# EAGLE design IR_sensor (EAGLE 9.6.2)
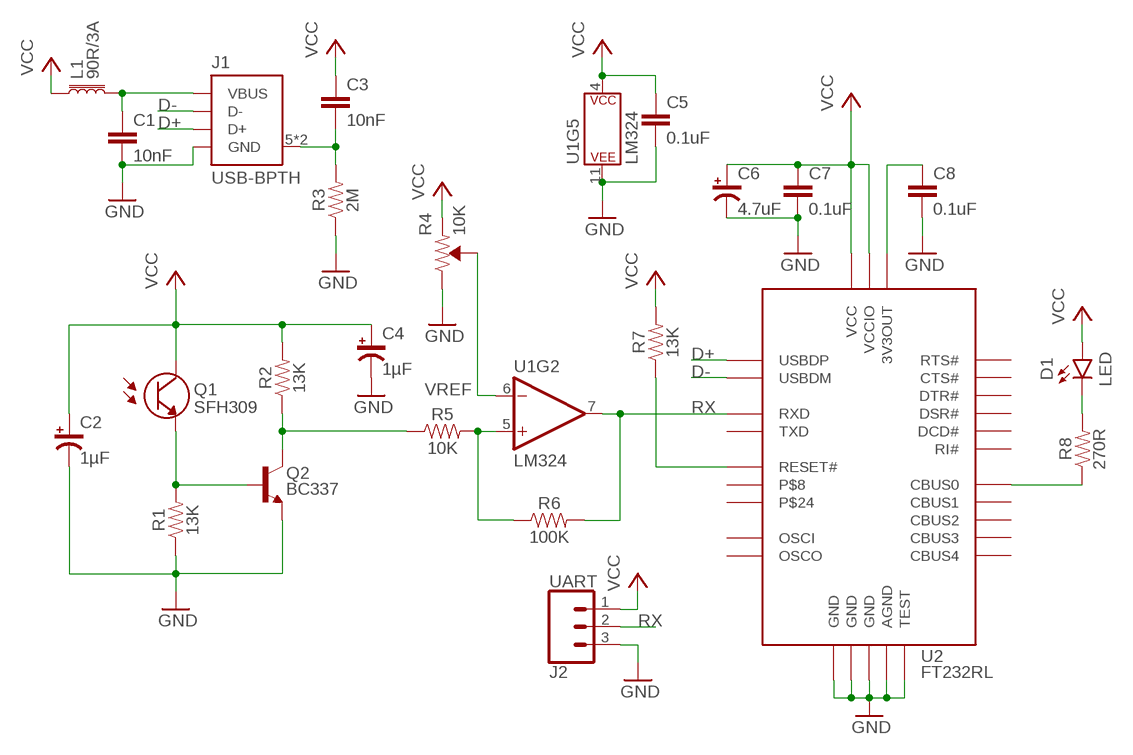
[diagram p0: schematic, sheet 1]

## Parts
C1  10nF  CAPPTH2.5MM  [CAP-PTH-2.5MM]
C2  1µF  CAP-POL  [CPOL-RADIAL-2.5MM-5MM]
C3  10nF  CAPPTH-5MM  [CAP-PTH-5MM]
C4  1µF  CAP-POL  [CPOL-RADIAL-2.5MM-5MM]
C5  0.1uF  CAPPTH-5MM  [CAP-PTH-5MM]
C6  4.7uF  CAP-POL  [CPOL-RADIAL-2.5MM-5MM]
C7  0.1uF  CAPPTH-5MM  [CAP-PTH-5MM]
C8  0.1uF  CAPPTH-5MM  [CAP-PTH-5MM]
D1  LED  LEDPTH-5MM  [LED_5MM]
J1  USB-BPTH  [USB-B-PTH]
J2  UART  CONN_03  [1X03]
L1  90R/3A  FERRITE_BEADPTH  [AXIAL-0.3]
Q1  SFH309  PHOTOTRANSISTORPTH-R  [LED_3MM_R]
Q2  BC337  NPNPTH  [TO-92]
R1  13K  RESISTORPTH  [AXIAL-0.3]
R2  13K  RESISTORPTH  [AXIAL-0.3]
R3  2M  RESISTORPTH  [AXIAL-0.3]
R4  10K  TRIMPOT  [TRIMPOT]
R5  10K  RESISTORPTH  [AXIAL-0.3]
R6  100K  RESISTORPTH  [AXIAL-0.3]
R7  13K  RESISTORPTH  [AXIAL-0.3]
R8  270R  RESISTORPTH  [AXIAL-0.3]
U1  LM324  OP_AMP  [DIP14]
U2  FT232RL  [TSSOP-28-BL]

## Nets
ADC: Q2.3(C) R2.P$1 R5.P$1
D+: J1.3(D+) U2.15(USBDP)
D-: J1.2(D-) U2.16(USBDM)
GND: C1.2 C2.2(-) C4.2(-) C5.2 C6.2(-) C7.2 C8.2 J1.4(GND) J2.3 Q2.1(E) R1.P$1 R3.P$1 R4.P$2(CW) U1.11(P$V-) U2.7(GND) U2.18(GND) U2.21(GND) U2.25(AGND) U2.26(TEST)
N$1: C1.1 J1.1(VBUS) L1.P$2
N$5: R5.P$2 R6.P$1 U1.5(+IN)
N$6: Q1.A(E) Q2.2(B) R1.P$2
N$7: C8.1 U2.17(3V3OUT)
N$8: D1.K R8.P$2
N$10: R8.P$1 U2.23(CBUS0)
N$12: C3.2 J1.5(SHIELD) J1.6(SHIELD) R3.P$2
N$13: R7.P$1 U2.19(RESET#)
RX: J2.2 R6.P$2 U1.7(OUT) U2.5(RXD)
VCC: C2.1(+) C3.1 C4.1(+) C5.1 C6.1(+) C7.1 D1.A J2.1 L1.P$1 Q1.K(C) R2.P$2 R4.P$1(CCW) R7.P$2 U1.4(P$V+) U2.4(VCCIO) U2.20(VCC)
VREF: R4.P$3(WIPER) U1.6(-IN)
Unconnected: U1.1(OUT) U1.2(-IN) U1.3(+IN) U1.8(OUT) U1.9(-IN) U1.10(+IN) U1.12(+IN) U1.13(-IN) U1.14(OUT) U2.1(TXD) U2.2(DTR#) U2.3(RTS#) U2.6(RI#) U2.8 U2.9(DSR#) U2.10(DCD#) U2.11(CTS#) U2.12(CBUS4) U2.13(CBUS2) U2.14(CBUS3) U2.22(CBUS1) U2.24 U2.27(OSCI) U2.28(OSCO)

## Library data of the parts
C1 C3 C5 C7 C8 = CUSTOM_COMPONENTS:CAP
C2 C4 C6 = CUSTOM_COMPONENTS:CAP-POL
D1 = CUSTOM_COMPONENTS:LED
J1 = CUSTOM_COMPONENTS:USB-B
J2 = CUSTOM_COMPONENTS:CONN_03: Multi connection point. Often used as Generic Header-pin footprint for 0.1 inch spaced/style header connections On any of the 0.1 inch spaced packages, you can populate with these: Break Away Headers - Straight <https://www.sparkfun.com/products/116> (PRT-00116) Break Away Male Headers - Right Angle <https://www.sparkfun.com/products/553> (PRT-00553) Female Headers <https://www.sparkfun.com/products/115> (PRT-00115) Break Away Headers - Machine Pin <https://www.sparkfun.com/products/117> (PRT-00117) Break Away Female Headers - Swiss Machine Pin <https://www.sparkfun.com/products/743> (PRT-00743) Stackable Header - 3 Pin (Female, 0.1") <https://www.sparkfun.com/products/13875> (PRT-13875) For SCREWTERMINALS and SPRING TERMINALS visit here: Screw Terimnals on SparkFun.com <https://www.sparkfun.com/search/results?term=Screw+Terminals> (5mm/3.5mm/2.54mm spacing) This device is also useful as a general connection point to wire up your design to another part of your project. Our various solder wires solder well into these plated through hole pads. Hook-Up Wire - Assortment (Stranded, 22 AWG) <https://www.sparkfun.com/products/11375> (PRT-11375) Hook-Up Wire - Assortment (Solid Core, 22 AWG) <https://www.sparkfun.com/products/11367> (PRT-11367) View the entire wire category on our website here <https://www.sparkfun.com/categories/141> Special notes: Molex polarized connector foot print use with SKU : PRT-08232 with associated crimp pins and housings.
L1 = CUSTOM_COMPONENTS:FERRITE_BEAD
Q1 = CUSTOM_COMPONENTS:PHOTOTRANSISTOR: Check prices <https://pricing.snapeda.com/parts/BPW85/Vishay/view-part?ref=eda>
Q2 = CUSTOM_COMPONENTS:NPN
R1-R3 R5-R8 = CUSTOM_COMPONENTS:RESISTOR
R4 = CUSTOM_COMPONENTS:TRIMPOT
U1 = CUSTOM_COMPONENTS:OP_AMP: IC Quad Op Amp Jellybean quad op-amp
U2 = CUSTOM_COMPONENTS:FT232RL

## Board
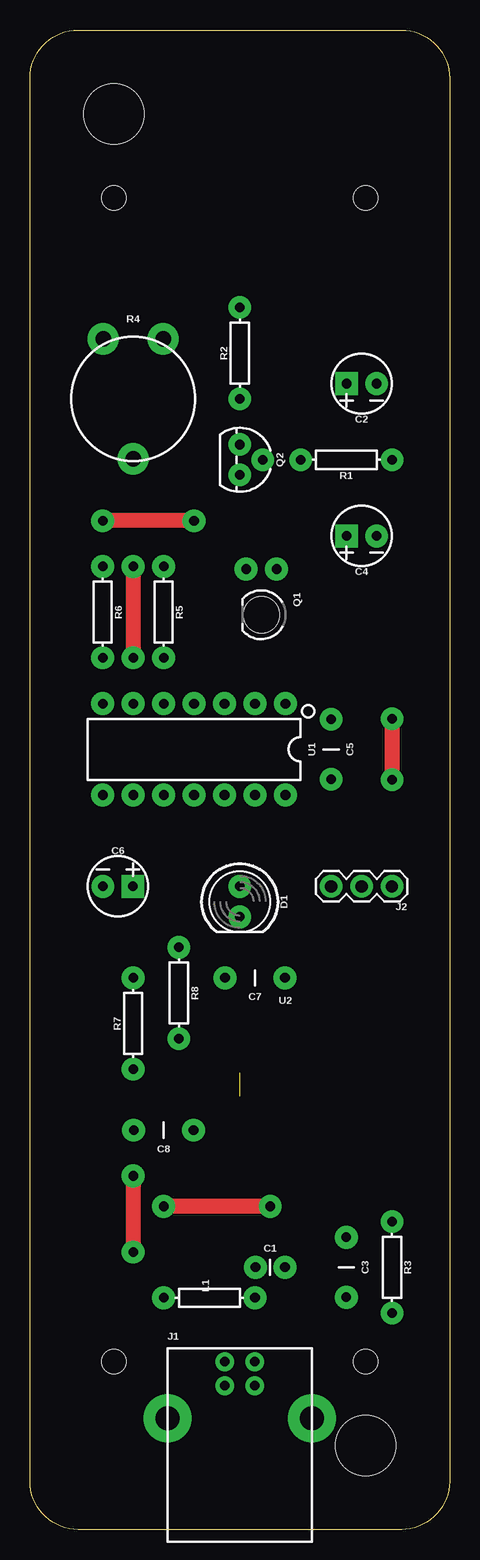
[diagram p1: board, top side]
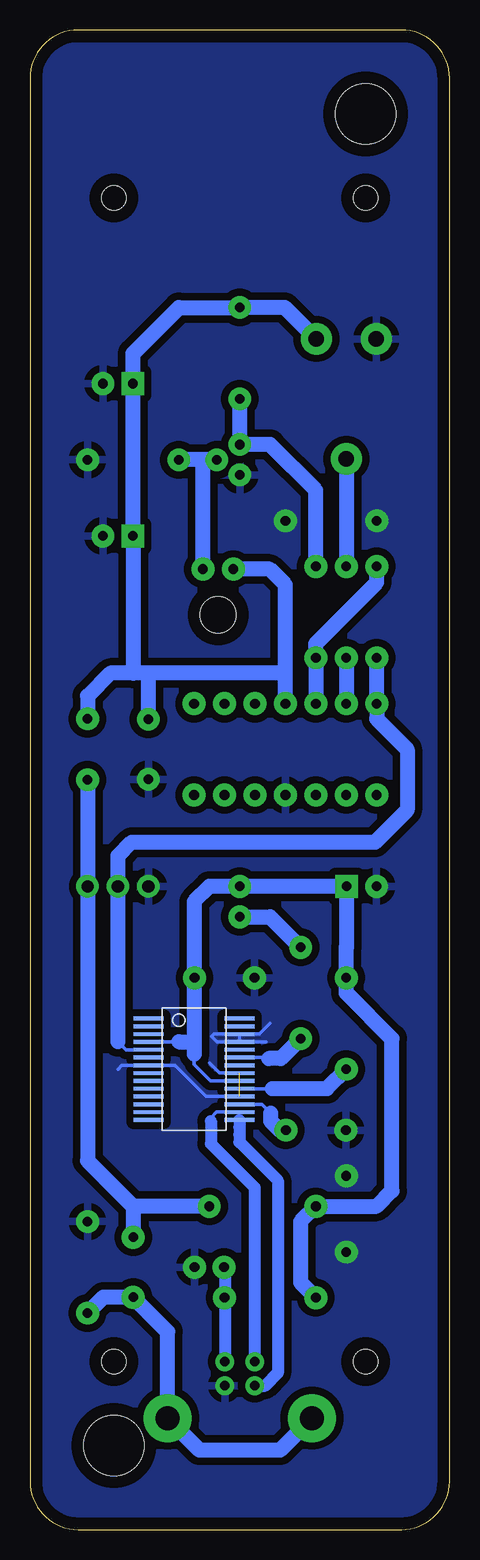
[diagram p2: board, bottom side, seen from below]

Size 35 x 125 mm. Coordinates in mm from the lower left corner, seen from the top.
Outline: 4,125 31,125 arc-90 35,121 35,4 arc-90 31,0 4,0 arc-90 0,4 0,121 arc-90 4,125
Copper layers (1*16): Top 0.035mm / dielectric 1.5mm / Bottom 0.035mm
Design rules "pth-smd-mix": minimum track width 10mil, minimum drill 0.35mm, track to track 24mil, track to pad 24mil, pad to pad 12mil, via to via 24mil, smd to smd 10mil, copper to edge 40mil, drill to drill 24mil, minimum pad ring 10mil, minimum via ring 8mil, stop-mask expansion 4mil, vias tented up to drill 0mil, thermal gap 24mil
Holes 2 mm at 28,111 7,111 28,14 7,14
Holes 5 mm at 28,7 7,118

### Footprints (pad centres in the part's own frame; a part is rotated, then mirrored left to right if it is on the bottom)
CAP-PTH-2.5MM = drill 0.8 pad 1.9: 1 -1.23,0; 2 1.23,0
CPOL-RADIAL-2.5MM-5MM = drill 0.8 pad 1.9 square: 1 1.25,0 | drill 0.8 pad 1.9: 2 -1.25,0
CAP-PTH-5MM = drill 0.8 pad 1.9: 1 -2.5,0; 2 2.5,0
LED_5MM = drill 0.8 pad 1.9: A -1.27,0; K 1.27,0
USB-B-PTH = drill 0.8 pad 1.575: 1 1.25,14.99; 2 -1.25,14.99; 3 -1.25,12.99; 4 1.25,12.99 | drill 2 pad 4: 5 -6.02,10.28; 6 6.02,10.28
1X03 = drill 1.016 pad 1.88: 1 0,0; 2 2.54,0; 3 5.08,0
AXIAL-0.3 = drill 0.8 pad 1.9: P$1 -3.81,0; P$2 3.81,0
LED_3MM_R = drill 0.8 pad 1.9: A -1.27,-3.81; K 1.27,-3.81 | hole 3: 0,0
TO-92 = drill 0.8 pad 1.88: 1 1.27,0; 2 0,1.905; 3 -1.27,0
TRIMPOT = drill 1.3 pad 2.6: P$1 -2.5,-5; P$2 2.5,-5; P$3 0,5
DIP14 = drill 0.8 pad 1.9: 1 -7.62,-3.81; 2 -5.08,-3.81; 3 -2.54,-3.81; 4 0,-3.81; 5 2.54,-3.81; 6 5.08,-3.81; 7 7.62,-3.81; 8 7.62,3.81; 9 5.08,3.81; 10 2.54,3.81; 11 0,3.81; 12 -2.54,3.81; 13 -5.08,3.81; 14 -7.62,3.81
TSSOP-28-BL = smd 2.5 x 0.32 bottom: 1 3.775,4.225; 2 3.775,3.575; 3 3.775,2.925; 4 3.775,2.275; 5 3.775,1.625; 6 3.775,0.975; 7 3.775,0.325; 8 3.775,-0.325; 9 3.775,-0.975; 10 3.775,-1.625; 11 3.775,-2.275; 12 3.775,-2.925; 13 3.775,-3.575; 14 3.775,-4.225; 15 -3.775,-4.225; 16 -3.775,-3.575; 17 -3.775,-2.925; 18 -3.775,-2.275; 19 -3.775,-1.625; 20 -3.775,-0.975; 21 -3.775,-0.325; 22 -3.775,0.325; 23 -3.775,0.975; 24 -3.775,1.625; 25 -3.775,2.275; 26 -3.775,2.925; 27 -3.775,3.575; 28 -3.775,4.225

### Placement (x,y rotation side)
C1  20.04,21.86 0 top
C2  27.66,95.52 180 top
C3  26.39,21.86 270 top
C4  27.66,82.82 180 top
C5  25.12,65.04 270 top
C6  7.34,53.61 0 top
C7  18.77,45.99 180 top
C8  11.15,33.29 180 top
D1  17.5,52.34 270 top
J1  17.5,-1 0 top
J2  30.2,53.61 180 top
L1  14.96,19.32 0 top
Q1  19.3,76.25 180 top
Q2  17.5,89.17 270 top
R1  26.39,89.17 180 top
R2  17.5,98.06 90 top
R3  30.2,21.86 270 top
R4  8.61,94.25 180 top
R5  11.15,76.47 270 top
R6  6.07,76.47 270 top
R7  8.61,42.18 90 top
R8  12.42,44.72 90 top
U1  13.69,65.04 180 top
U2  21.31,38.37 0 top

### Tracks (layer width: path | path; a pad name or v marks a point on that pad's centre or on a via)
ADC
  Bottom 1.27: R5.P$1 11.15,86.63 14.96,90.44 Q2.3 R2.P$1
D+
  Bottom 1.016: J1.3 15.36,11.99 14.32,13.04 14.32,29.1 17.54,32.31 arc0 U2.15
D-
  Bottom 0.305: U2.16 19.42,34.8 19.91,34.31 19.91,34.05
  Bottom 1.016: J1.2 16.25,28.48 19.91,32.15 19.91,34.05
GND  (via drill 0.8 pad 1.9)  (1 unrouted)
  Top 1.27: v13.69,84.09 v6.07,84.09 | v8.61,29.48 v8.61,23.13
  Bottom 0.305: U2.18 20.3,36.09 22.91,38.7 U2.7 27.34,38.7 27.66,38.37 | U2.26 19.66,41.3 19.85,41.1 19.39,40.64 U2.25 | U2.25 U2.26 | U2.26 15.85,41.3 14.96,42.18 | U2.25 15.33,40.64 | U2.21 19.21,38.05 20.04,38.88
  pour Bottom: 4,0 31,0 arc90 35,4 35,121 arc90 31,125 4,125 arc90 0,121 0,4 arc90
N$1
  Bottom 1.016: L1.P$2 18.75,19.32 | 18.75,19.32 18.75,21.86 C1.1 | 18.75,19.32 J1.1
N$5
  Bottom 1.27: R6.P$1 6.07,78.94 11.19,73.82 11.19,72.7 R5.P$2 U1.5
N$6
  Bottom 1.27: Q2.2 20.55,89.17 | 20.55,89.17 R1.P$2 | Q1.A 20.57,89.15 20.55,89.17
N$7
  Bottom 0.305: U2.17 15.66,35.45 14.92,34.71
  Bottom 1.27: C8.1 14.16,33.29 14.92,34.05 14.92,34.71
N$8
  Bottom 1.27: D1.K 14.96,51.07 R8.P$2
N$10
  Bottom 0.305: U2.23 15.17,39.34 15.09,39.26
  Bottom 1.27: 15.09,39.26 14.07,39.26 R8.P$1
N$12
  Bottom 1.27: J1.5 14.14,6.62 20.86,6.62 J1.6 23.52,16.49 C3.2 28.89,19.36 R3.P$2
N$13
  Bottom 0.305: U2.19 14.81,36.75 14.8,36.75
  Bottom 1.27: R7.P$1 10.23,36.75 14.8,36.75
RX
  Bottom 0.305: U2.5 27,40 27.66,40.66
  Bottom 1.27: R6.P$2 U1.7 6.07,67.58 3.53,65.04 3.53,59.96 6.2,57.29 26.52,57.29 27.66,56.15 J2.2 27.66,40.66
VCC  (via drill 0.8 pad 1.9)
  Top 1.27: v30.2,67.58 v30.2,62.5 | v20.04,26.94 v11.15,26.94
  Bottom 0.305: U2.20 19.95,37.39 21.31,38.75 21.31,39.64 | U2.4 22.6,40.64 22.59,40.66
  Bottom 1.27: U1.4 13.69,71.39 | R4.P$1 13.73,101.87 R2.P$2 22.58,101.87 26.41,98.04 C2.1 C4.1 26.39,82.8 26.39,71.39 | v30.2,67.58 30.2,69.48 28.3,71.39 26.39,71.39 | 13.69,71.39 25.12,71.39 | 25.12,71.39 26.39,71.39 | Q1.K 14.99,80.06 13.69,78.76 13.69,71.39 | C5.1 25.12,71.39 | v20.04,26.94 26.39,26.94 | 26.39,26.94 C3.1 | L1.P$1 12.42,20.59 12.42,25.67 v11.15,26.94 6.07,26.94 4.8,28.21 4.8,40.91 8.61,44.72 R7.P$2 8.61,48.53 8.59,48.55 C6.1 D1.A 20.04,53.61 21.31,52.34 21.31,45.99 C7.1 21.31,45.95 21.31,40.91 | v30.2,62.5 J2.1 30.2,30.75 26.39,26.94 | 21.31,40.91 21.31,39.64 | 21.31,40.91 21.56,40.66 22.59,40.66
VREF  (via drill 0.8 pad 1.9)
  Top 1.27: v8.61,80.28 v8.61,72.66
  Bottom 1.27: v8.61,72.66 U1.6 | R4.P$3 v8.61,80.28